# Altium schematic sheet rs485-interface.SchDoc
size A; SheetNumber: 3; SheetTotal: 3
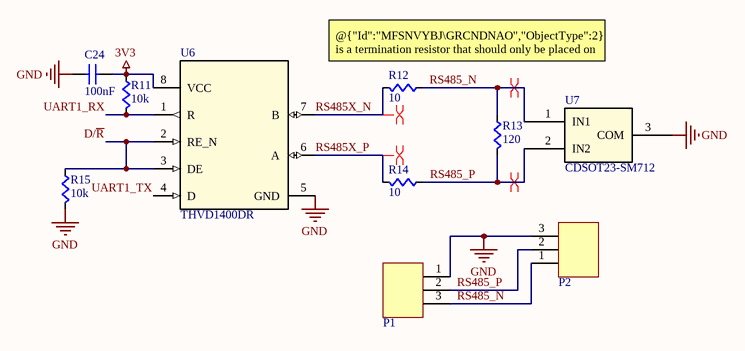
[diagram p0: rs485-interface.SchDoc]

## Parts
C24  value 100nF  [CAPC0603]  (hidden comment: Cap)
P1  3pos RA sherlock connector  [MOLEX-HDR-1X3-SHERLOCK-RA]  (value not drawn)
P2  3pos RA sherlock connector  [MOLEX-HDR-1X3-SHERLOCK-RA]  (value not drawn)
R11  value 10k  [RES0603]  (hidden comment: Res)
R12  value 10  [RES0603]  (hidden comment: Res)
R13  value 120  [RES0603]  (hidden comment: Res)
R14  value 10  [RES0603]  (hidden comment: Res)
R15  value 10k  [RES0603]  (hidden comment: Res)
U6  THVD1400DR  [D0008B-MFG]
U7  CDSOT23-SM712  [SOT_SM712]

## Nets
3V3: C24.2(B) R11.2(B) U6.8(VCC)
GND: C24.1(A) P1.1 P2.3 R15.1(A) U6.5(GND) U7.3(COM)
D/~{R}: R15.2(B) U6.2(RE_N) U6.3(DE)
RS485_N: P1.3 P2.1 R12.2(B) R13.2(B) U7.1(IN1)
RS485_P: P1.2 P2.2 R13.1(A) R14.2(B) U7.2(IN2)
RS485X_N: R12.1(A) U6.7(B)
RS485X_P: R14.1(A) U6.6(A)
UART1_RX: R11.1(A) U6.1(R)
UART1_TX: U6.4(D)

## Layout directives
differential pair: RS485_N, RS485_P, RS485X_N, RS485X_P

## Notes on the sheet
- (near R12) @{"Id":"MFSNVYBJ\GRCNDNAO","ObjectType":2} is a termination resistor that should only be placed on start or end nodes of the daisy chain

## Library data of the parts
P1 P2 = MOLEX-HDR-1x3-SHERLOCK_RA: Header, Molex, 2mm Pitch Sherlock Header, Single Row, Right Angle 3 Circuits, Length 3.3mm; Manufacturer Part Number: 35363-0360; Manufacturer: Molex Connector Corporation; Supplier Part Number 1: WM18932-ND; Supplier 1: Digi-Key
R11-R15 = Res: SMD, RES0603; Supplier 1: Digi-Key; Supplier Part Number 1: RMCF0603JT10K0CT-ND
U6 = THVD1400DR: 3.3-V to 5-V, 500-Kbps, RS-485 transceiver in small package option with &plusmn;12-kV IEC ESD pro 8-SOIC -40 to 125; Manufacturer_Name: Texas Instruments; TYPE: TYPE; RefDes: RefDes; Copyright: Copyright (C) 2026 Ultra Librarian. All rights reserved.; Manufacturer_Part_Number: THVD1400DR
U7 = CDSOT23-SM712: TVS DIODE 12VWM 7VWM SOT23-3; Manufacturer_Name: Bourns Electronics; Copyright: Copyright (C) 2026 Ultra Librarian. All rights reserved.; Manufacturer_Part_Number: CDSOT23-SM712; RefDes: RefDes; Type: Type
C24 = Cap: Supplier 1: Digi-Key; Supplier Part Number 1: 1276-1000-1-ND